# Altium schematic sheet BMS-SYSTEM-POWER.SchDoc
size A2; SheetNumber: 2; SheetTotal: 32
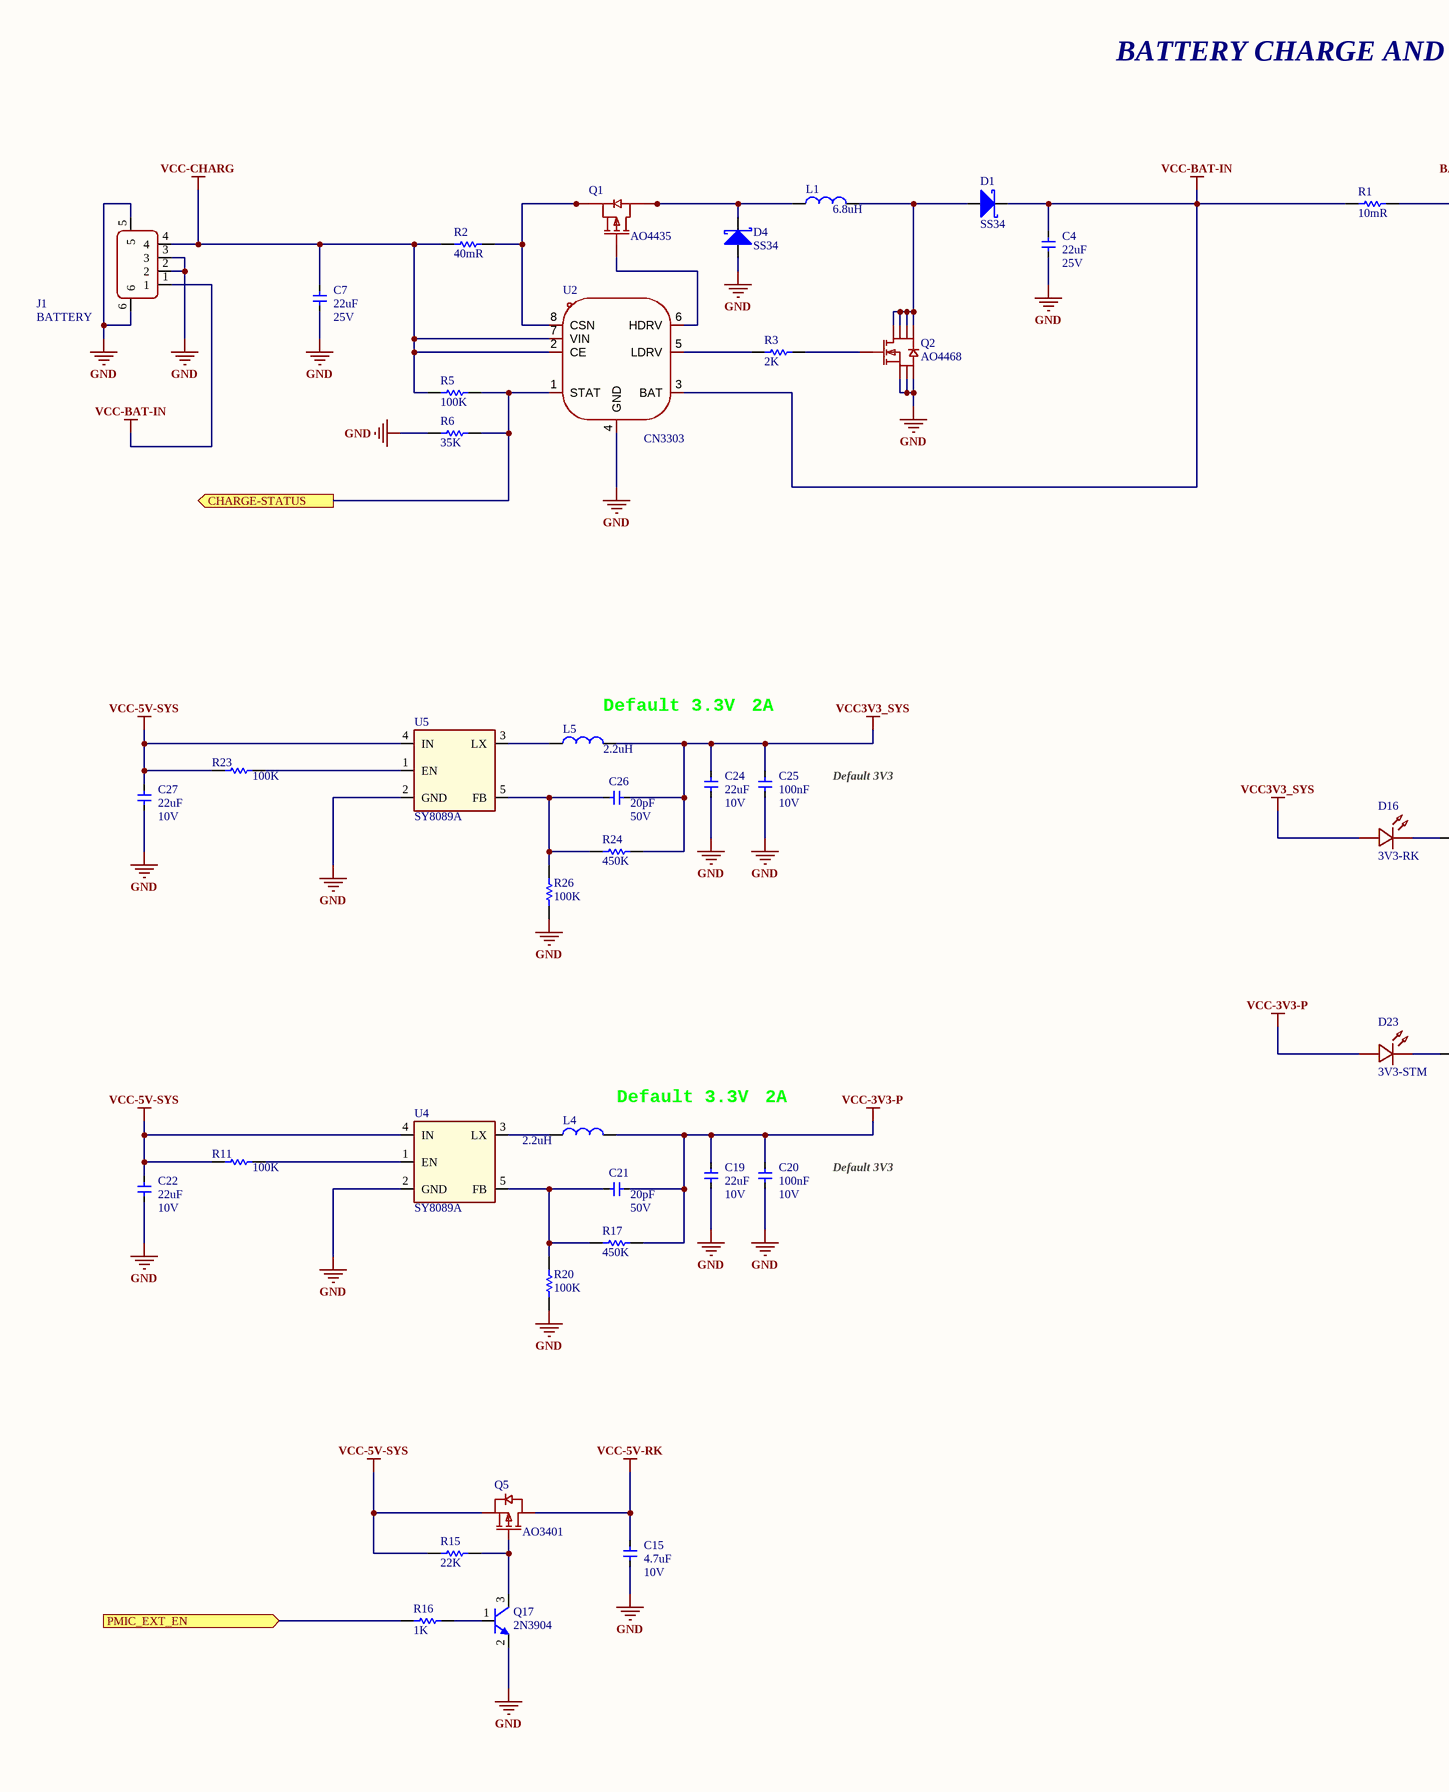
[diagram p0: BMS-SYSTEM-POWER.SchDoc, left]
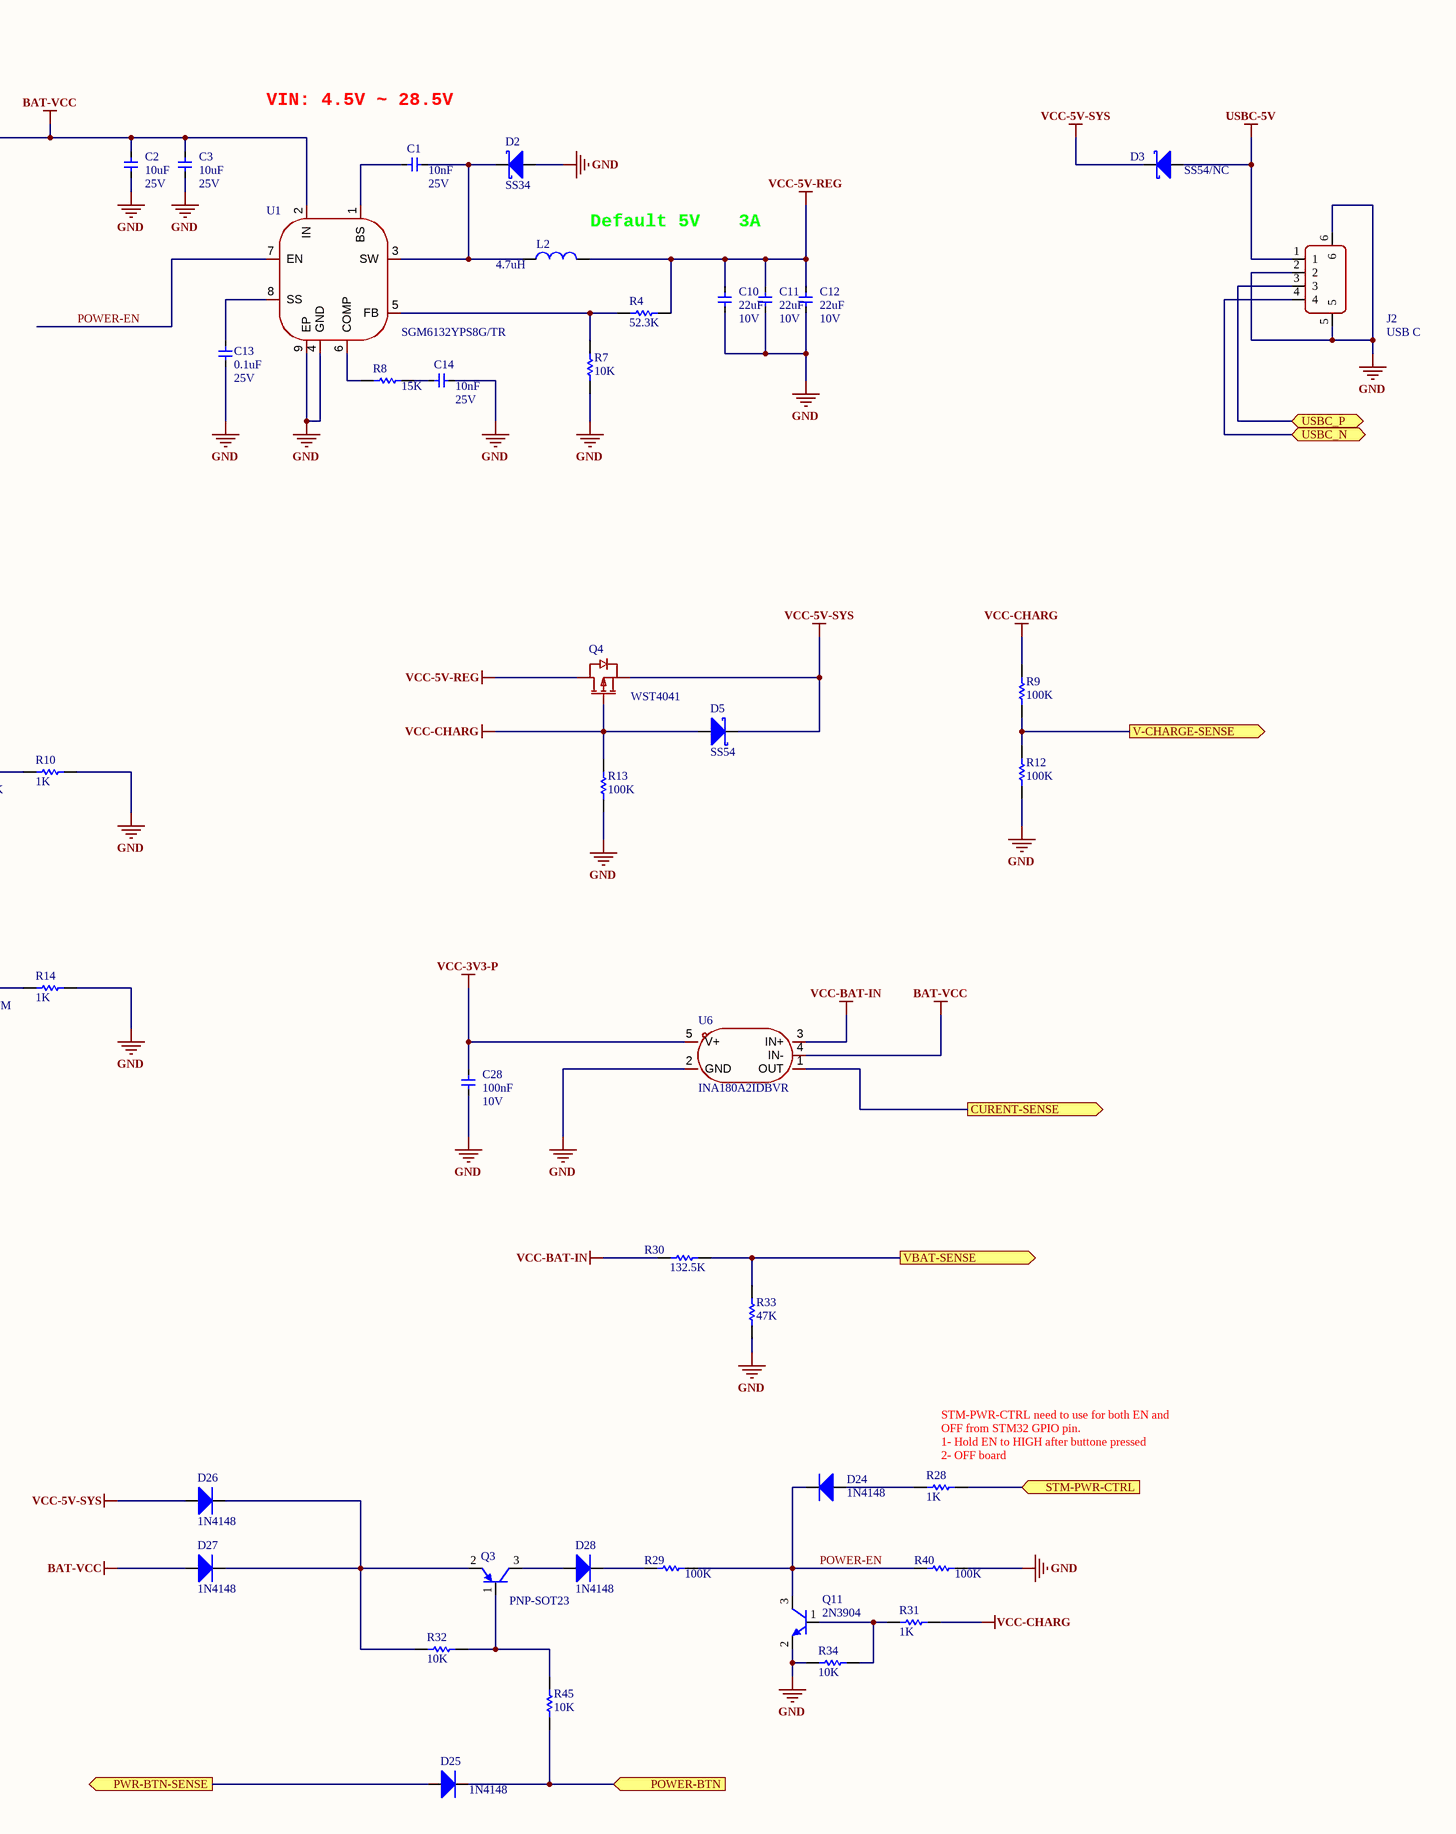
[diagram p1: BMS-SYSTEM-POWER.SchDoc, right]

## Parts
C1  10nF  VoltageRate: 25V  [CAP-0402]
C2  10uF  VoltageRate: 25V  [CAP-0805-S]
C3  10uF  VoltageRate: 25V  [CAP-0805-S]
C4  22uF  VoltageRate: 25V  [C1206]
C7  22uF  VoltageRate: 25V  [C1206]
C10  22uF  VoltageRate: 10V  [CAP-0805-S]
C11  22uF  VoltageRate: 10V  [CAP-0805-S]
C12  22uF  VoltageRate: 10V  [CAP-0805-S]
C13  0.1uF  VoltageRate: 25V  [CAP-0402]
C14  10nF  VoltageRate: 25V  [CAP-0402]
C15  4.7uF  VoltageRate: 10V  [CAP-0603]
C19  22uF  VoltageRate: 10V  [CAP-0603]
C20  100nF  VoltageRate: 10V  [CAP-0402]
C21  20pF  VoltageRate: 50V  [CAP-0402]
C22  22uF  VoltageRate: 10V  [CAP-0603]
C24  22uF  VoltageRate: 10V  [CAP-0603]
C25  100nF  VoltageRate: 10V  [CAP-0402]
C26  20pF  VoltageRate: 50V  [CAP-0402]
C27  22uF  VoltageRate: 10V  [CAP-0603]
C28  100nF  VoltageRate: 10V  [CAP-0402]
D1  SS34  [SMA]
D2  SS34  [SMA]
D3  SS54/NC  [SMB_L4.3-W3.6-LS5.4-RD]
D4  SS34  [SMA]
D5  SS54  [SMB_L4.3-W3.6-LS5.4-RD]
D16  3V3-RK  [LED0603-B]
D23  3V3-STM  [LED0603-B]
D24  1N4148  [SOD123]
D25  1N4148  [SOD123]
D26  1N4148  [SOD123]
D27  1N4148  [SOD123]
D28  1N4148  [SOD123]
J1  BATTERY  [CONN-SMD_4P-P2.00_XUNPU_WAFER-PH2.0-4PWB]
J2  USB C  [CONN-SMD_4P-P2.00_XUNPU_WAFER-PH2.0-4PWB]
L1  6.8uH  [IND-SMD_L7.0-W6.6]
L2  4.7uH  [IND-SMD_L7.0-W6.6]
L4  2.2uH  [IND-SMD_L4.4-W4.2]
L5  2.2uH  [IND-SMD_L4.4-W4.2]
Q1  AO4435  [SOP-8_L4.9-W3.9-P1.27-LS6.0-BL-1]
Q2  AO4468  [SOP-8_L4.9-W3.9-P1.27-LS6.0-BL-1]
Q3  PNP-SOT23  [SOT23-3D]
Q4  WST4041  [SOT23-3D]
Q5  AO3401  [SOT23-3D]
Q11  2N3904  [SOT23-3D]
Q17  2N3904  [SOT23-3D]
R1  10mR  [RES-1206]
R2  40mR  [R1210]
R3  2K  [RES-0402]
R4  52.3K  [RES-0402]
R5  100K  [RES-0402]
R6  35K  [RES-0402]
R7  10K  [RES-0402]
R8  15K  [RES-0402]
R9  100K  [RES-0402]
R10  1K  [RES-0402]
R11  100K  [RES-0402]
R12  100K  [RES-0402]
R13  100K  [RES-0402]
R14  1K  [RES-0402]
R15  22K  [RES-0402]
R16  1K  [RES-0402]
R17  450K  [RES-0402]
R20  100K  [RES-0402]
R23  100K  [RES-0402]
R24  450K  [RES-0402]
R26  100K  [RES-0402]
R28  1K  [RES-0402]
R29  100K  [RES-0402]
R30  132.5K  [RES-0402]
R31  1K  [RES-0402]
R32  10K  [RES-0402]
R33  47K  [RES-0402]
R34  10K  [RES-0402]
R40  100K  [RES-0402]
R45  10K  [RES-0402]
U1  SGM6132YPS8G/TR  [SOIC-8_L4.9-W3.9-P1.27-LS6.0-BL-EP3.4]
U2  CN3303  [SOP-8_L4.9-W3.9-P1.27-LS6.0-BL-1]
U4  SY8089A  [SOT5P95B160_300H130]
U5  SY8089A  [SOT5P95B160_300H130]
U6  INA180A2IDBVR  [SOT_23_5]

## Ports
CHARGE-STATUS (out, see Controller-RK3562-TOP[4D], STM32G070RBT6[4B]), CURENT-SENSE (out, see Controller-RK3562-TOP[4D], STM32G070RBT6[2B]), PMIC_EXT_EN (in, see Controller-RK3562-TOP[5D], CONTROLLER-RK3562[1B], RK-POWER-SUPPLY[1A]), POWER-BTN (in, see Controller-RK3562-TOP[4D], BUTTON-LEDs [3C]), PWR-BTN-SENSE (out, see Controller-RK3562-TOP[4D], STM32G070RBT6[2B]), STM-PWR-CTRL (in, see Controller-RK3562-TOP[4D], STM32G070RBT6[2B]), USBC_N (bidir, see Controller-RK3562-TOP[5C], CONTROLLER-RK3562[7D]), USBC_P (bidir, see Controller-RK3562-TOP[5C], CONTROLLER-RK3562[7D]), V-CHARGE-SENSE (out, see Controller-RK3562-TOP[4D], STM32G070RBT6[4B]), VBAT-SENSE (out, see Controller-RK3562-TOP[4D], STM32G070RBT6[2B])

## Nets
BAT-VCC: C2.2 C3.2 D27.1(A) R1.2 U1.2(IN) U6.4(IN-)
GND: C2.1 C3.1 C4.1 C7.1 C10.1 C11.1 C12.1 C13.2 C14.1 C15.1 C19.1 C20.1 C22.1 C24.1 C25.1 C27.1 C28.1 D2.1(A) D4.1(A) J1.2 J1.3 J1.5 J1.6 J2.2 J2.5 J2.6 Q2.1(S) Q2.2(S) Q2.3(S) Q11.2(E) Q17.2(E) R6.2 R7.1 R10.1 R12.1 R13.1 R14.1 R20.2 R26.2 R33.1 R34.2 R40.2 U1.4(GND) U1.9(EP) U2.4(GND) U4.2(GND) U5.2(GND) U6.2(GND)
USBC-5V: D3.1(A) J2.1
VCC3V3_SYS: C24.2 C25.2 C26.1 D16.1 L5.2 R24.1
VCC-3V3-P: C19.2 C20.2 C21.1 C28.2 D23.1 L4.2 R17.1 U6.5(V+)
VCC-5V-REG: C10.2 C11.2 C12.2 L2.2 Q4.3(D) R4.2
VCC-5V-RK: C15.2 Q5.3(D)
VCC-5V-SYS: C22.2 C27.2 D3.2(K) D5.2(K) D26.1(A) Q4.2(S) Q5.2(S) R11.1 R15.1 R23.1 U4.4(IN) U5.4(IN)
VCC-BAT-IN: C4.2 D1.2(K) J1.1 R1.1 R30.1 U2.3(BAT) U6.3(IN+)
VCC-CHARG: C7.2 D5.1(A) J1.4 Q4.1(G) R2.1 R5.2 R9.2 R13.2 R31.2 U2.2(CE) U2.7(VIN)
CHARGE-STATUS: R5.1 R6.1 U2.1(STAT) ; port CHARGE-STATUS
CURENT-SENSE: U6.1(OUT) ; port CURENT-SENSE
PMIC_EXT_EN: R16.1 ; port PMIC_EXT_EN
POWER-BTN: D25.2(K) R45.1 ; port POWER-BTN
POWER-EN: D24.2(K) Q11.3(C) R29.2 R40.1 U1.7(EN)
PWR-BTN-SENSE: D25.1(A) ; port PWR-BTN-SENSE
STM-PWR-CTRL: R28.2 ; port STM-PWR-CTRL
USBC_N: J2.4 ; port USBC_N
USBC_P: J2.3 ; port USBC_P
V-CHARGE-SENSE: R9.1 R12.2 ; port V-CHARGE-SENSE
VBAT-SENSE: R30.2 R33.2 ; port VBAT-SENSE
NetC1_1: C1.1 D2.2(K) L2.1 U1.3(SW)
NetC1_2: C1.2 U1.1(BS)
NetC13_1: C13.1 U1.8(SS)
NetC14_2: C14.2 R8.1
NetC21_2: C21.2 R17.2 R20.1 U4.5(FB)
NetC26_2: C26.2 R24.2 R26.1 U5.5(FB)
NetD1_1: D1.1(A) L1.2 Q2.5(D) Q2.6(D) Q2.7(D) Q2.8(D)
NetD4_2: D4.2(K) L1.1 Q1.5(D) Q1.6(D) Q1.7(D) Q1.8(D)
NetD16_2: D16.2 R10.2
NetD23_2: D23.2 R14.2
NetD24_1: D24.1(A) R28.1
NetD26_2: D26.2(K) D27.2(K) Q3.2(E) R32.2
NetD28_1: D28.1(A) Q3.3(C)
NetD28_2: D28.2(K) R29.1
NetL4_1: L4.1 U4.3(LX)
NetL5_1: L5.1 U5.3(LX)
NetQ1_1: Q1.1(S) Q1.2(S) Q1.3(S) R2.2 U2.8(CSN)
NetQ1_4: Q1.4(G) U2.6(HDRV)
NetQ2_4: Q2.4(G) R3.1
NetQ3_1: Q3.1(B) R32.1 R45.2
NetQ5_1: Q5.1(G) Q17.3(C) R15.2
NetQ11_1: Q11.1(B) R31.1 R34.1
NetQ17_1: Q17.1(B) R16.2
NetR3_2: R3.2 U2.5(LDRV)
NetR4_1: R4.1 R7.2 U1.5(FB)
NetR8_2: R8.2 U1.6(COMP)
NetR11_2: R11.2 U4.1(EN)
NetR23_2: R23.2 U5.1(EN)

## Notes on the sheet
- BATTERY CHARGE AND POWER MANAGMENT
- VIN: 4.5V ~ 28.5V
- (near L2) Default 5V
- 3A
- (near L5) Default 3.3V
- 2A
- Default 3V3
- (near L4) Default 3.3V
- (near R28) STM-PWR-CTRL need to use for both EN and OFF from STM32 GPIO pin.
  1- Hold EN to HIGH after buttone pressed
  2- OFF board

## Library data of the parts
C1-C4 C7 C10-C15 C19-C22 C24-C28 = Capacitor-1: ManufacturingPartNumber: *; Manufacturer: *; SupplierPartNumber: *; Supplier: *
D1-D5 = DIODE-2: ManufacturingPartNumber: *; Manufacturer: *; SupplierPartNumber: *; Supplier: *; VoltageRate: *
D16 D23 = LED-SMD: ManufacturingPartNumber: *; Manufacturer: *; SupplierPartNumber: *; Supplier: *; VoltageRate: *
D24-D28 = DIODE-1: ManufacturingPartNumber: *; Manufacturer: *; SupplierPartNumber: *; Supplier: *; VoltageRate: *
J1 J2 = HDRx4: ManufacturingPartNumber: *; Manufacturer: *; SupplierPartNumber: *; Supplier: *; VoltageRate: *
L1 = INDUCTOR-SMD: FXL0630-6R8-M; ManufacturingPartNumber: *; Manufacturer: *; SupplierPartNumber: *; Supplier: *; VoltageRate: *
L2 = INDUCTOR-SMD: FXL0630-4R7-M; ManufacturingPartNumber: *; Manufacturer: *; SupplierPartNumber: *; Supplier: *; VoltageRate: *
L4 L5 = INDUCTOR-SMD: FXL0420-2R2-M; ManufacturingPartNumber: *; Manufacturer: *; SupplierPartNumber: *; Supplier: *; VoltageRate: *
Q1 = AO4407A: ManufacturingPartNumber: *; Manufacturer: *; SupplierPartNumber: *; Supplier: *; VoltageRate: *
Q2 = NCE3018AS: ManufacturingPartNumber: *; Manufacturer: *; SupplierPartNumber: *; Supplier: *; VoltageRate: *
Q4 Q5 = P-MOS-SOT23: ManufacturingPartNumber: *; Manufacturer: *; SupplierPartNumber: *; Supplier: *; VoltageRate: *
Q11 Q17 = NPN-SOT23: ManufacturingPartNumber: *; Manufacturer: *; SupplierPartNumber: *; Supplier: *; VoltageRate: *
R1-R17 R20 R23 R24 R26 R28-R34 R40 R45 = Resistor-1: ManufacturingPartNumber: *; Manufacturer: *; SupplierPartNumber: *; Supplier: *; VoltageRate: *
U4 U5 = SY8089A_0: ManufacturingPartNumber: *; Manufacturer: *; SupplierPartNumber: *; Supplier: *; VoltageRate: *
Q3 = PNP-SOT23: ManufacturingPartNumber: *; Manufacturer: *; SupplierPartNumber: *; Supplier: *; VoltageRate: *
U1 = SGM6132YPS8G/TR: ManufacturingPartNumber: *; Manufacturer: *; SupplierPartNumber: *; Supplier: *; VoltageRate: *
U2 = CN3303: ManufacturingPartNumber: *; Manufacturer: *; SupplierPartNumber: *; Supplier: *; VoltageRate: *
U6 = INA180A2IDBVR: ManufacturingPartNumber: *; Manufacturer: *; SupplierPartNumber: *; Supplier: *; VoltageRate: *